# Altium schematic sheet 05-Power_Sources.SchDoc
size A4; Author: Fabian Castaño; CompanyName: GIBIC Tech-Hub; Engineer: Fabian Castaño; Organization: Universidad de Antioquia; Address1: UdeA; Address2: Medellín; Address3: Antioquia; Address4: Colombia 050010
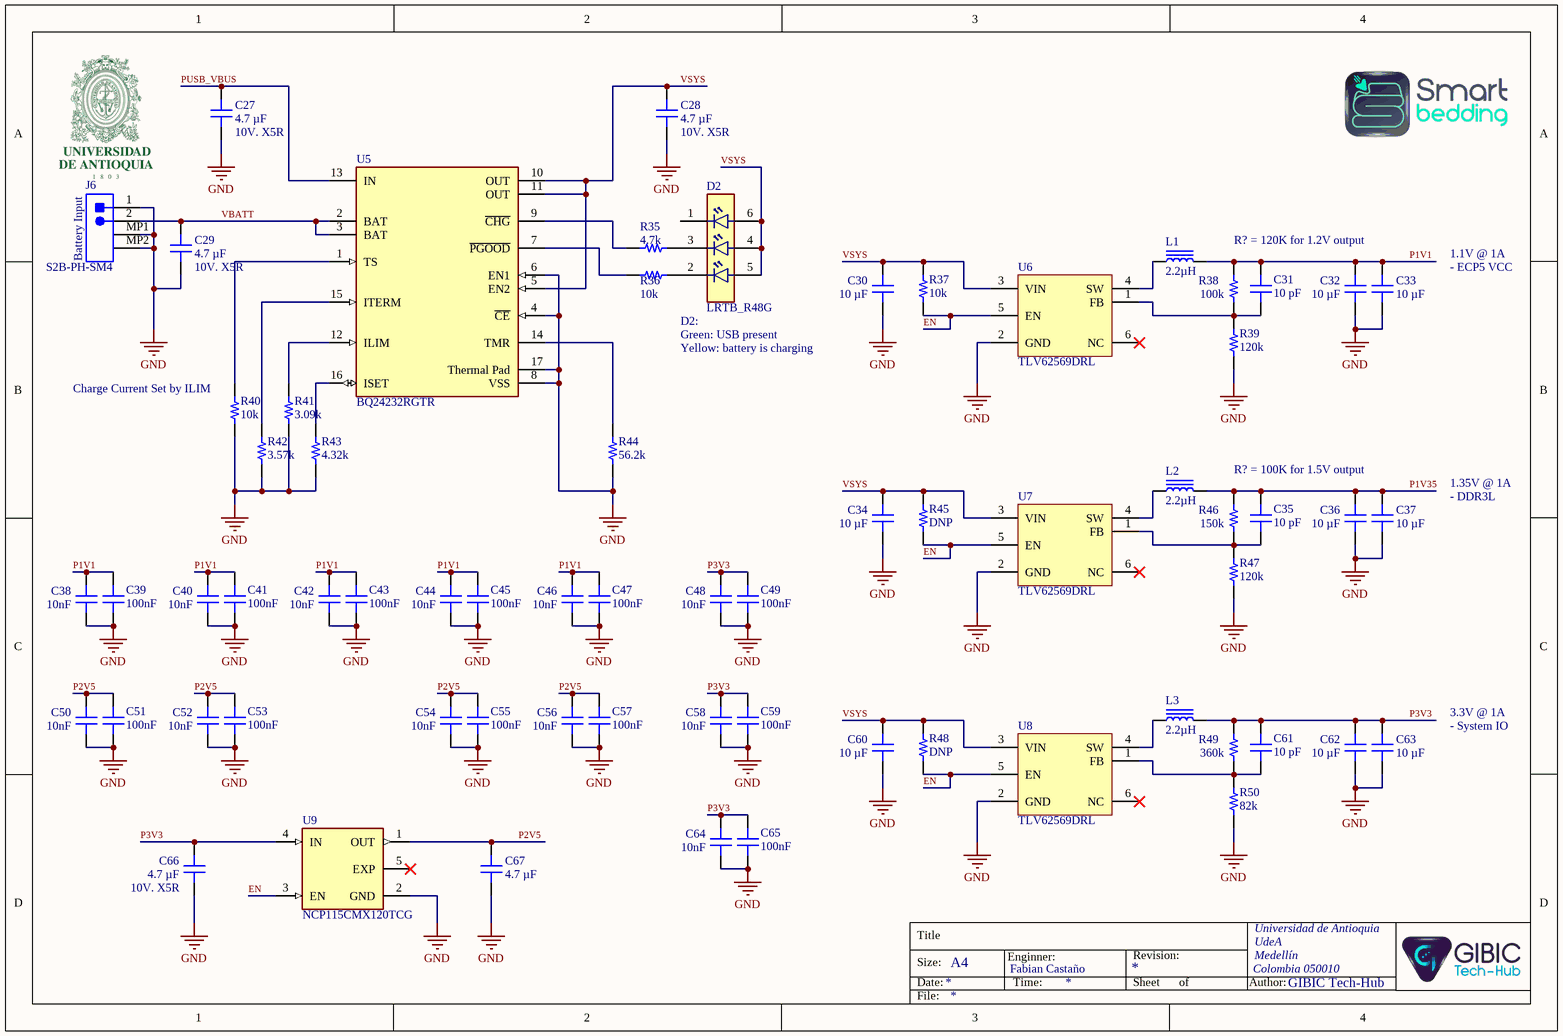
[diagram p0: 05-Power_Sources.SchDoc]

## Parts
C27  4.7 µF  Voltage: 10V. X5R  [CAP 0402_1005]
C28  4.7 µF  Voltage: 10V. X5R  [CAP 0402_1005]
C29  4.7 µF  Voltage: 10V. X5R  [CAP 0402_1005]
C30  10 µF  [CAP 0402_1005]
C31  10 pF  [CAP 0201_0603]
C32  10 µF  [CAP 0402_1005]
C33  10 µF  [CAP 0402_1005]
C34  10 µF  [CAP 0402_1005]
C35  10 pF  [CAP 0201_0603]
C36  10 µF  [CAP 0402_1005]
C37  10 µF  [CAP 0402_1005]
C38  10nF  [CAP 0201_0603]
C39  100nF  [CAP 0201_0603]
C40  10nF  [CAP 0201_0603]
C41  100nF  [CAP 0201_0603]
C42  10nF  [CAP 0201_0603]
C43  100nF  [CAP 0201_0603]
C44  10nF  [CAP 0201_0603]
C45  100nF  [CAP 0201_0603]
C46  10nF  [CAP 0201_0603]
C47  100nF  [CAP 0201_0603]
C48  10nF  [CAP 0201_0603]
C49  100nF  [CAP 0201_0603]
C50  10nF  [CAP 0201_0603]
C51  100nF  [CAP 0201_0603]
C52  10nF  [CAP 0201_0603]
C53  100nF  [CAP 0201_0603]
C54  10nF  [CAP 0201_0603]
C55  100nF  [CAP 0201_0603]
C56  10nF  [CAP 0201_0603]
C57  100nF  [CAP 0201_0603]
C58  10nF  [CAP 0201_0603]
C59  100nF  [CAP 0201_0603]
C60  10 µF  [CAP 0402_1005]
C61  10 pF  [CAP 0201_0603]
C62  10 µF  [CAP 0402_1005]
C63  10 µF  [CAP 0402_1005]
C64  10nF  [CAP 0201_0603]
C65  100nF  [CAP 0201_0603]
C66  4.7 µF  Voltage: 10V. X5R  [CAP 0402_1005]
C67  4.7 µF  [CAP 0402_1005]
D2  LRTB_R48G  [LRTB_R48G]
J6  S2B-PH-SM4  [JST-S2B-PH-SM4-TB(LF)(SN)-2_V]
L1  2.2µH  [IND 0806_2016]
L2  2.2µH  [IND 0806_2016]
L3  2.2µH  [IND 0806_2016]
R35  4.7k  [RES 0201_0603]
R36  10k  [RES 0201_0603]
R37  10k  [RES 0201_0603]
R38  100k  [RES 0201_0603]
R39  120k  [RES 0201_0603]
R40  10k  [RES 0201_0603]
R41  3.09k  [RES 0201_0603]
R42  3.57k  [RES 0201_0603]
R43  4.32k  [RES 0201_0603]
R44  56.2k  [RES 0201_0603]
R45  DNP  [RES 0201_0603]
R46  150k  [RES 0201_0603]
R47  120k  [RES 0201_0603]
R48  DNP  [RES 0201_0603]
R49  360k  [RES 0201_0603]
R50  82k  [RES 0201_0603]
U5  BQ24232RGTR  [FP-RGTR_MFG]
U6  TLV62569DRL  [SOT50P160X60-6N]
U7  TLV62569DRL  [SOT50P160X60-6N]
U8  TLV62569DRL  [SOT50P160X60-6N]
U9  NCP115CMX120TCG  [VREG_NCP115CMX120TCG]

## Nets
GND: C27.2 C28.2 C29.2 C30.1 C32.1 C33.1 C34.1 C36.1 C37.1 C38.1 C39.1 C40.1 C41.1 C42.1 C43.1 C44.1 C45.1 C46.1 C47.1 C48.1 C49.1 C50.1 C51.1 C52.1 C53.1 C54.1 C55.1 C56.1 C57.1 C58.1 C59.1 C60.1 C62.1 C63.1 C64.1 C65.1 C66.2 C67.2 J6.1 J6.MP1 J6.MP2 R39.1 R40.1 R41.1 R42.1 R43.1 R44.1 R47.1 R50.1 U5.4(~{CE}) U5.6(EN1) U5.8(VSS) U5.17(Thermal_Pad) U6.2(GND) U7.2(GND) U8.2(GND) U9.2(GND)
EN: R37.1 R45.1 R48.1 U6.5(EN) U7.5(EN) U8.5(EN) U9.3(EN)
P1V1: C31.2 C32.2 C33.2 C38.2 C39.2 C40.2 C41.2 C42.2 C43.2 C44.2 C45.2 C46.2 C47.2 L1.2 R38.2
P1V35: C35.2 C36.2 C37.2 L2.2 R46.2
P2V5: C50.2 C51.2 C52.2 C53.2 C54.2 C55.2 C56.2 C57.2 C67.1 U9.1(OUT)
P3V3: C48.2 C49.2 C58.2 C59.2 C61.2 C62.2 C63.2 C64.2 C65.2 C66.1 L3.2 R49.2 U9.4(IN)
PUSB_VBUS: C27.1 U5.13(IN)
VBATT: C29.1 J6.2 U5.2(BAT) U5.3(BAT)
VSYS: C28.1 C30.2 C34.2 C60.2 D2.4(RED_A) D2.5(GREEN_A) D2.6(BLUE_A) R37.2 R45.2 R48.2 U5.5(EN2) U5.10(OUT) U5.11(OUT) U6.3(VIN) U7.3(VIN) U8.3(VIN)
NetC31_1: C31.1 R38.1 R39.2 U6.1(FB)
NetC35_1: C35.1 R46.1 R47.2 U7.1(FB)
NetC61_1: C61.1 R49.1 R50.2 U8.1(FB)
NetD2_2: D2.2(GREEN_C) R36.1
NetD2_3: D2.3(RED_C) R35.1
NetL1_1: L1.1 U6.4(SW)
NetL2_1: L2.1 U7.4(SW)
NetL3_1: L3.1 U8.4(SW)
NetR35_2: R35.2 U5.9(~{CHG})
NetR36_2: R36.2 U5.7(~{PGOOD})
NetR40_2: R40.2 U5.1(TS)
NetR41_2: R41.2 U5.12(ILIM)
NetR42_2: R42.2 U5.15(ITERM)
NetR43_2: R43.2 U5.16(ISET)
NetR44_2: R44.2 U5.14(TMR)

Not connected (* = marked no-connect by the designer): D2 1(BLUE_C); U6 6(NC)*; U7 6(NC)*; U8 6(NC)*; U9 5(EXP)*

## Notes on the sheet
- R? = 120K for 1.2V output
- (near J6) Battery Input
- 1.1V @ 1A
- - ECP5 VCC
- D2:
- Green: USB present
- Yellow: battery is charging
- (near R40) Charge Current Set by ILIM
- R? = 100K for 1.5V output
- 1.35V @ 1A
- - DDR3L
- 3.3V @ 1A
- - System IO
- Title
- Size:
- Date:
- A4
- Enginner:
- Time:
- Revision:
- Sheet
- of
- Author:
- File:

## Library data of the parts
C27-C29 C66 C67 = C1005X6S0G475M050BC: CAP CER 4.7UF 4V X6S 0402; manufacturer: TDK Corporation; Tolerance: ±20%; Part Number: C1005X6S0G475M050BC; Value: 4.7 µF; Applications: General Purpose; Capacitance: 4.7 µF; componentlink1description: Datasheet; componentlink1url: https://product.tdk.com/info/en/catalog/datasheets/mlcc_commercial_general_en.pdf?ref_disty=digikey; componentlink2description: DigiKey Link; componentlink2url: https://www.digikey.com/en/products/detail/tdk-corporation/C1005X6S0G475M050BC/2792242; Device Package: 0402 (1005 Metric); Features: Low ESL; lastupdated: 3/01/2023 8:04:20 p. m.; Lifecycle Status: Active; Minimum Order: 1; Mounting Type: Surface Mount, MLCC; Operating Temperature: -55°C ~ 105°C; Package / Case: 0402 (1005 Metric); packaging: TapeAndReel; partid: 1756; Part Status: Active; price: 0.07; series: C; Size / Dimension: 0.039" L x 0.020" W (1.00mm x 0.50mm); Supplier 1: DigiKey; Supplier Part Number 1: 445-8017-1-ND; Temperature Coefficient: X6S; Thickness (Max): 0.026" (0.65mm); Voltage - Rated: 4V
C30 C32-C34 C36 C37 C60 C62 C63 = CL05A106MP8NUB8: CAP CER 10UF 10V X5R 0402; manufacturer: Samsung Electro-Mechanics; Tolerance: ±20%; Part Number: CL05A106MP8NUB8; Value: 10 µF; Applications: Acoustic Noise Reduction; Capacitance: 10 µF; componentlink1description: Datasheet; componentlink1url: http://www.samsungsem.com/kr/support/product-search/mlcc/CL05A106MP8NUB8.jsp; componentlink2description: DigiKey Link; componentlink2url: https://www.digikey.com/en/products/detail/samsung-electro-mechanics/CL05A106MP8NUB8/5961314; Device Package: 0402 (1005 Metric); lastupdated: 3/01/2023 8:04:20 p. m.; Lifecycle Status: Active; Minimum Order: 1; Mounting Type: Surface Mount, MLCC; Operating Temperature: -55°C ~ 85°C; Package / Case: 0402 (1005 Metric); packaging: TapeAndReel; partid: 1758; Part Status: Active; price: 0.06; series: CL; Size / Dimension: 0.039" L x 0.020" W (1.00mm x 0.50mm); Supplier 1: DigiKey; Supplier Part Number 1: 1276-6830-1-ND; Temperature Coefficient: X5R; Thickness (Max): 0.035" (0.90mm); Voltage - Rated: 10V
C31 C35 C61 = C0201C100J3GAC7867: CAP CER 10PF 25V C0G/NP0 0201; manufacturer: KEMET; Temperature Coefficient: C0G, NP0; Tolerance: ±5%; Part Number: C0201C100J3GAC7867; Value: 10 pF; Applications: General Purpose; Capacitance: 10 pF; componentlink1description: Datasheet; componentlink1url: https://api.kemet.com/component-edge/download/datasheet/C0201C100J3GAC7867.pdf; componentlink2description: DigiKey Link; componentlink2url: https://www.digikey.com/en/products/detail/kemet/C0201C100J3GAC7867/7381972; Device Package: 0201 (0603 Metric); Features: Low ESL; lastupdated: 3/01/2023 8:01:19 p. m.; Lifecycle Status: Active; Minimum Order: 1; Mounting Type: Surface Mount, MLCC; Operating Temperature: -55°C ~ 125°C; Package / Case: 0201 (0603 Metric); packaging: TapeAndReel; partid: 4; Part Status: Active; price: 0.02; series: SMD Comm C0G; Size / Dimension: 0.024" L x 0.012" W (0.60mm x 0.30mm); Supplier 1: DigiKey; Supplier Part Number 1: 399-14856-1-ND; Thickness (Max): 0.013" (0.33mm); Voltage - Rated: 25V
C38 C40 C42 C44 C46 C48 C50 C52 C54 C56 C58 C64 = 0201ZC103JAT2A: CAP CER 10000PF 10V X7R 0201; manufacturer: AVX Corporation; Tolerance: ±5%; Part Number: 0201ZC103JAT2A; Value: 10nF; Applications: General Purpose; Capacitance: 10000pF; componentlink1description: Datasheet; componentlink1url: http://datasheets.avx.com/X7RDielectric.pdf; componentlink2description: DigiKey Link; componentlink2url: http://digikey.com/product-detail/en/avx-corporation/0201ZC103JAT2A/478-10776-1-ND/7536320; Device Package: 0201 (0603 Metric); lastupdated: 2/09/2020 12:59:12 a. m.; Lifecycle Status: Active; Minimum Order: 1; Mounting Type: Surface Mount, MLCC; Operating Temperature: -55°C ~ 125°C; Package / Case: 0201 (0603 Metric); packaging: TapeAndReel; partid: 786; Part Status: Active; price: 0.01; series: -; Size / Dimension: 0.024" L x 0.012" W (0.60mm x 0.30mm); Supplier 1: DigiKey; Supplier Part Number 1: 478-10776-1-ND; Temperature Coefficient: X7R; Thickness (Max): 0.013" (0.33mm); Voltage - Rated: 10V
C39 C41 C43 C45 C47 C49 C51 C53 C55 C57 C59 C65 = GRT033C80J104KE01J: CAP CER 0.1UF 6.3V X6S 0201; manufacturer: Murata Electronics; Capacitance: 0.1 µF; Tolerance: ±10%; Part Number: GRT033C80J104KE01J; Value: 100nF; Applications: Automotive; componentlink1description: Datasheet; componentlink1url: https://search.murata.co.jp/Ceramy/image/img/A01X/G101/ENG/GRT033C80J104KE01-01.pdf; componentlink2description: DigiKey Link; componentlink2url: https://www.digikey.com/en/products/detail/murata-electronics/GRT033C80J104KE01J/13905086; Device Package: 0201 (0603 Metric); lastupdated: 3/01/2023 8:00:58 p. m.; Lifecycle Status: Active; Minimum Order: 1; Mounting Type: Surface Mount, MLCC; Operating Temperature: -55°C ~ 105°C; Package / Case: 0201 (0603 Metric); packaging: CutTape; partid: 29730; Part Status: Active; price: 0.01; Ratings: AEC-Q200; series: GRT; Size / Dimension: 0.024" L x 0.012" W (0.60mm x 0.30mm); Supplier 1: DigiKey; Supplier Part Number 1: 490-GRT033C80J104KE01JCT-ND; Temperature Coefficient: X6S; Thickness (Max): 0.013" (0.33mm); Voltage - Rated: 6.3V
D2 = LRTB_R48G: RGB LED LRTB R48G
J6 = S2B-PH-SM4: Male Header, Pitch 2 mm, 1 x 2 Position, Height 5.5 mm
L1-L3 = ASMPM-0806-2R2M-T: FIXED IND 2.2UH 1.4A 168MOHM; Manufacturer: Abracon LLC; Current Rating (Amps): 1.6A; Current - Saturation: 2A; DC Resistance (DCR): 168mOhm Max; Inductance Frequency - Test: 100kHz; Material - Core: Ceramic; Shielding: Unshielded; Tolerance: ±20%; Type: Multilayer; Part Number: ASMPM-0806-2R2M-T; ComponentLink1Description: Datasheet; ComponentLink1URL: https://abracon.com/Magnetics/power/ASMPM.pdf; ComponentLink2Description: DigiKey Link; ComponentLink2URL: http://digikey.com/product-detail/en/abracon-llc/ASMPM-0806-2R2M-T/535-14172-1-ND/8259990; Device Package: 0806 (2016 Metric); Height - Seated (Max): 0.039" (1.00mm); Inductance: 2.2µH; LastUpdated: 2/01/2023 9:04:13 p. m.; Lifecycle Status: Active; Minimum Order: 0; Mounting Type: Surface Mount; Operating Temperature: -40°C ~ 125°C; Package / Case: 0806 (2016 Metric); Packaging: TapeAndReel; PartId: 3058; Part Status: Active; Price: 0.14; Series: ASMPM; Size / Dimension: 0.079" L x 0.063" W (2.00mm x 1.60mm); Supplier 1: DigiKey; Supplier Part Number 1: 535-14172-1-ND; Supplier Device Package: 0806 (2016 Metric); Value: 2.2µH
R35-R37 R40-R45 R48 = ERA-1AEB103C: RES SMD 10K OHM 0.1% 1/20W 0201; Manufacturer: Panasonic Electronic Components; Power (Watts): 0.05W, 1/20W; Resistance: 10 kOhms; Temperature Coefficient: ±25ppm/°C; Part Number: ERA-1AEB103C; ComponentLink1Description: Datasheet; ComponentLink1URL: https://industrial.panasonic.com/cdbs/www-data/pdf/RDM0000/AOA0000C307.pdf; ComponentLink2Description: DigiKey Link; ComponentLink2URL: https://www.digikey.com/en/products/detail/panasonic-electronic-components/ERA-1AEB103C/5035568; Composition: Thin Film; Device Package: 0201 (0603 Metric); Features: Automotive AEC-Q200; Height - Seated (Max): 0.010" (0.26mm); LastUpdated: 3/01/2023 8:15:23 p. m.; Lifecycle Status: Active; Minimum Order: 1; Number of Terminations: 2; Operating Temperature: -55°C ~ 155°C; Package / Case: 0201 (0603 Metric); Packaging: TapeAndReel; PartId: 598; Part Status: Active; Price: 0.06; Ratings: AEC-Q200; Series: ERA-1A; Size / Dimension: 0.024" L x 0.012" W (0.60mm x 0.30mm); Supplier 1: DigiKey; Supplier Part Number 1: P10KBXCT-ND; Supplier Device Package: 0201; Tolerance: ±0.1%
  R35: Value: 4.7k
  R36 R37 R40: Value: 10k
  R41: Value: 3.09k
  R42: Value: 3.57k
  R43: Value: 4.32k
  R44: Value: 56.2k
  R45 R48: Value: DNP
R38 R39 R46 R47 R49 R50 = PFR03S-104-JNH: RES SMD 100K OHM 5% 1/20W 0201; Manufacturer: Delta Electronics/Cyntec; Power (Watts): 0.05W, 1/20W; Resistance: 100 kOhms; Temperature Coefficient: ±200ppm/°C; Part Number: PFR03S-104-JNH; ComponentLink1Description: Datasheet; ComponentLink1URL: http://www.cyntec.com/upfile/products/download/RK000000NH%20_A4_PFR03S.pdf; ComponentLink2Description: DigiKey Link; ComponentLink2URL: https://www.digikey.com/en/products/detail/delta-electronics-cyntec/PFR03S-104-JNH/9761665; Composition: Thick Film; Device Package: 0201 (0603 Metric); Height - Seated (Max): 0.010" (0.26mm); LastUpdated: 3/01/2023 8:15:21 p. m.; Lifecycle Status: Active; Minimum Order: 1; Number of Terminations: 2; Operating Temperature: -55°C ~ 125°C; Package / Case: 0201 (0603 Metric); Packaging: CutTape; PartId: 917; Part Status: Active; Price: 0.01; Series: PFR03S; Size / Dimension: 0.024" L x 0.012" W (0.60mm x 0.30mm); Supplier 1: DigiKey; Supplier Part Number 1: 2037-PFR03S-104-JNHCT-ND; Supplier Device Package: 0201; Tolerance: ±5%
  R38: Value: 100k
  R39 R47: Value: 120k
  R46: Value: 150k
  R49: Value: 360k
  R50: Value: 82k
U5 = BQ24232RGTR: IC LI-ION CHARGE PWR MGMT 16QFN BQ24232RGTR
U6-U8 = TLV62569DRL: 2.5V-5.5V input, 2-A high efficiency step-down buck converter in SOT23 and SOT563 package
U9 = NCP115CMX120TCG: Linear Voltage Regulator IC Positive Fixed 1 Output 300mA 4-XDFN (1x1); MF: ON Semiconductor; MP: NCP115CMX120TCG; Purchase-URL: https://pricing.snapeda.com/search/part/NCP115CMX120TCG/?ref=eda; SnapEDA_Link: https://www.snapeda.com/parts/NCP115CMX120TCG/Onsemi/view-part/?ref=snap; Price: None; Package: XDFN-4 ON Semiconductor; Value: *; Check_prices: https://www.snapeda.com/parts/NCP115CMX120TCG/Onsemi/view-part/?ref=eda; Availability: In Stock